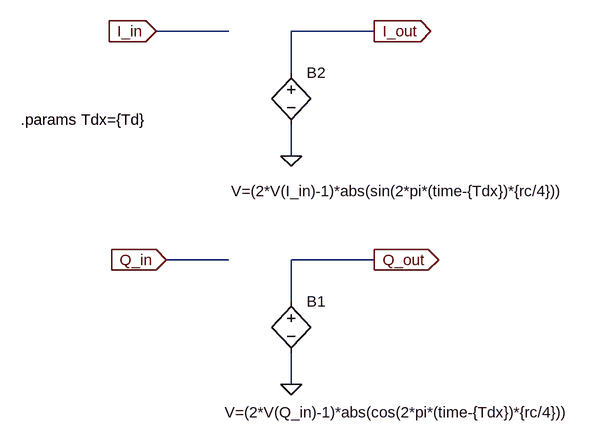
[diagram p0: schematic pulse_shaping.asc]
pulse_shaping.asc, the LTspice schematic file:
Version 4
SHEET 1 880 680
WIRE -96 -128 -208 -128
WIRE -96 224 -192 224
WIRE 0 -64 0 -128
WIRE 0 64 0 16
WIRE 0 288 0 224
WIRE 0 416 0 368
WIRE 128 -128 0 -128
WIRE 128 224 0 224
FLAG 0 416 0
FLAG 0 64 0
FLAG -208 -128 I_in
IOPIN -208 -128 In
FLAG -192 224 Q_in
IOPIN -192 224 In
FLAG 128 -128 I_out
IOPIN 128 -128 Out
FLAG 128 224 Q_out
IOPIN 128 224 Out
SYMBOL bv 0 272 R0
WINDOW 3 -102 187 Left 0
SYMATTR Value V=(2*V(Q_in)-1)*abs(cos(2*pi*(time-{Tdx})*{rc/4}))
SYMATTR InstName B1
SYMBOL bv 0 -80 R0
WINDOW 3 -92 198 Left 0
SYMATTR Value V=(2*V(I_in)-1)*abs(sin(2*pi*(time-{Tdx})*{rc/4}))
SYMATTR InstName B2
TEXT -416 8 Left 0 !.params Tdx={Td}

The netlist it stands for:
* pulse_shaping.asc
B1 Q_out 0 V=(2*V(Q_in)-1)*abs(cos(2*pi*(time-{Tdx})*{rc/4}))
B2 I_out 0 V=(2*V(I_in)-1)*abs(sin(2*pi*(time-{Tdx})*{rc/4}))
.params Tdx={Td}
.backanno
.end